# Altium schematic sheet 蔬菜大棚.SchDoc
size A3
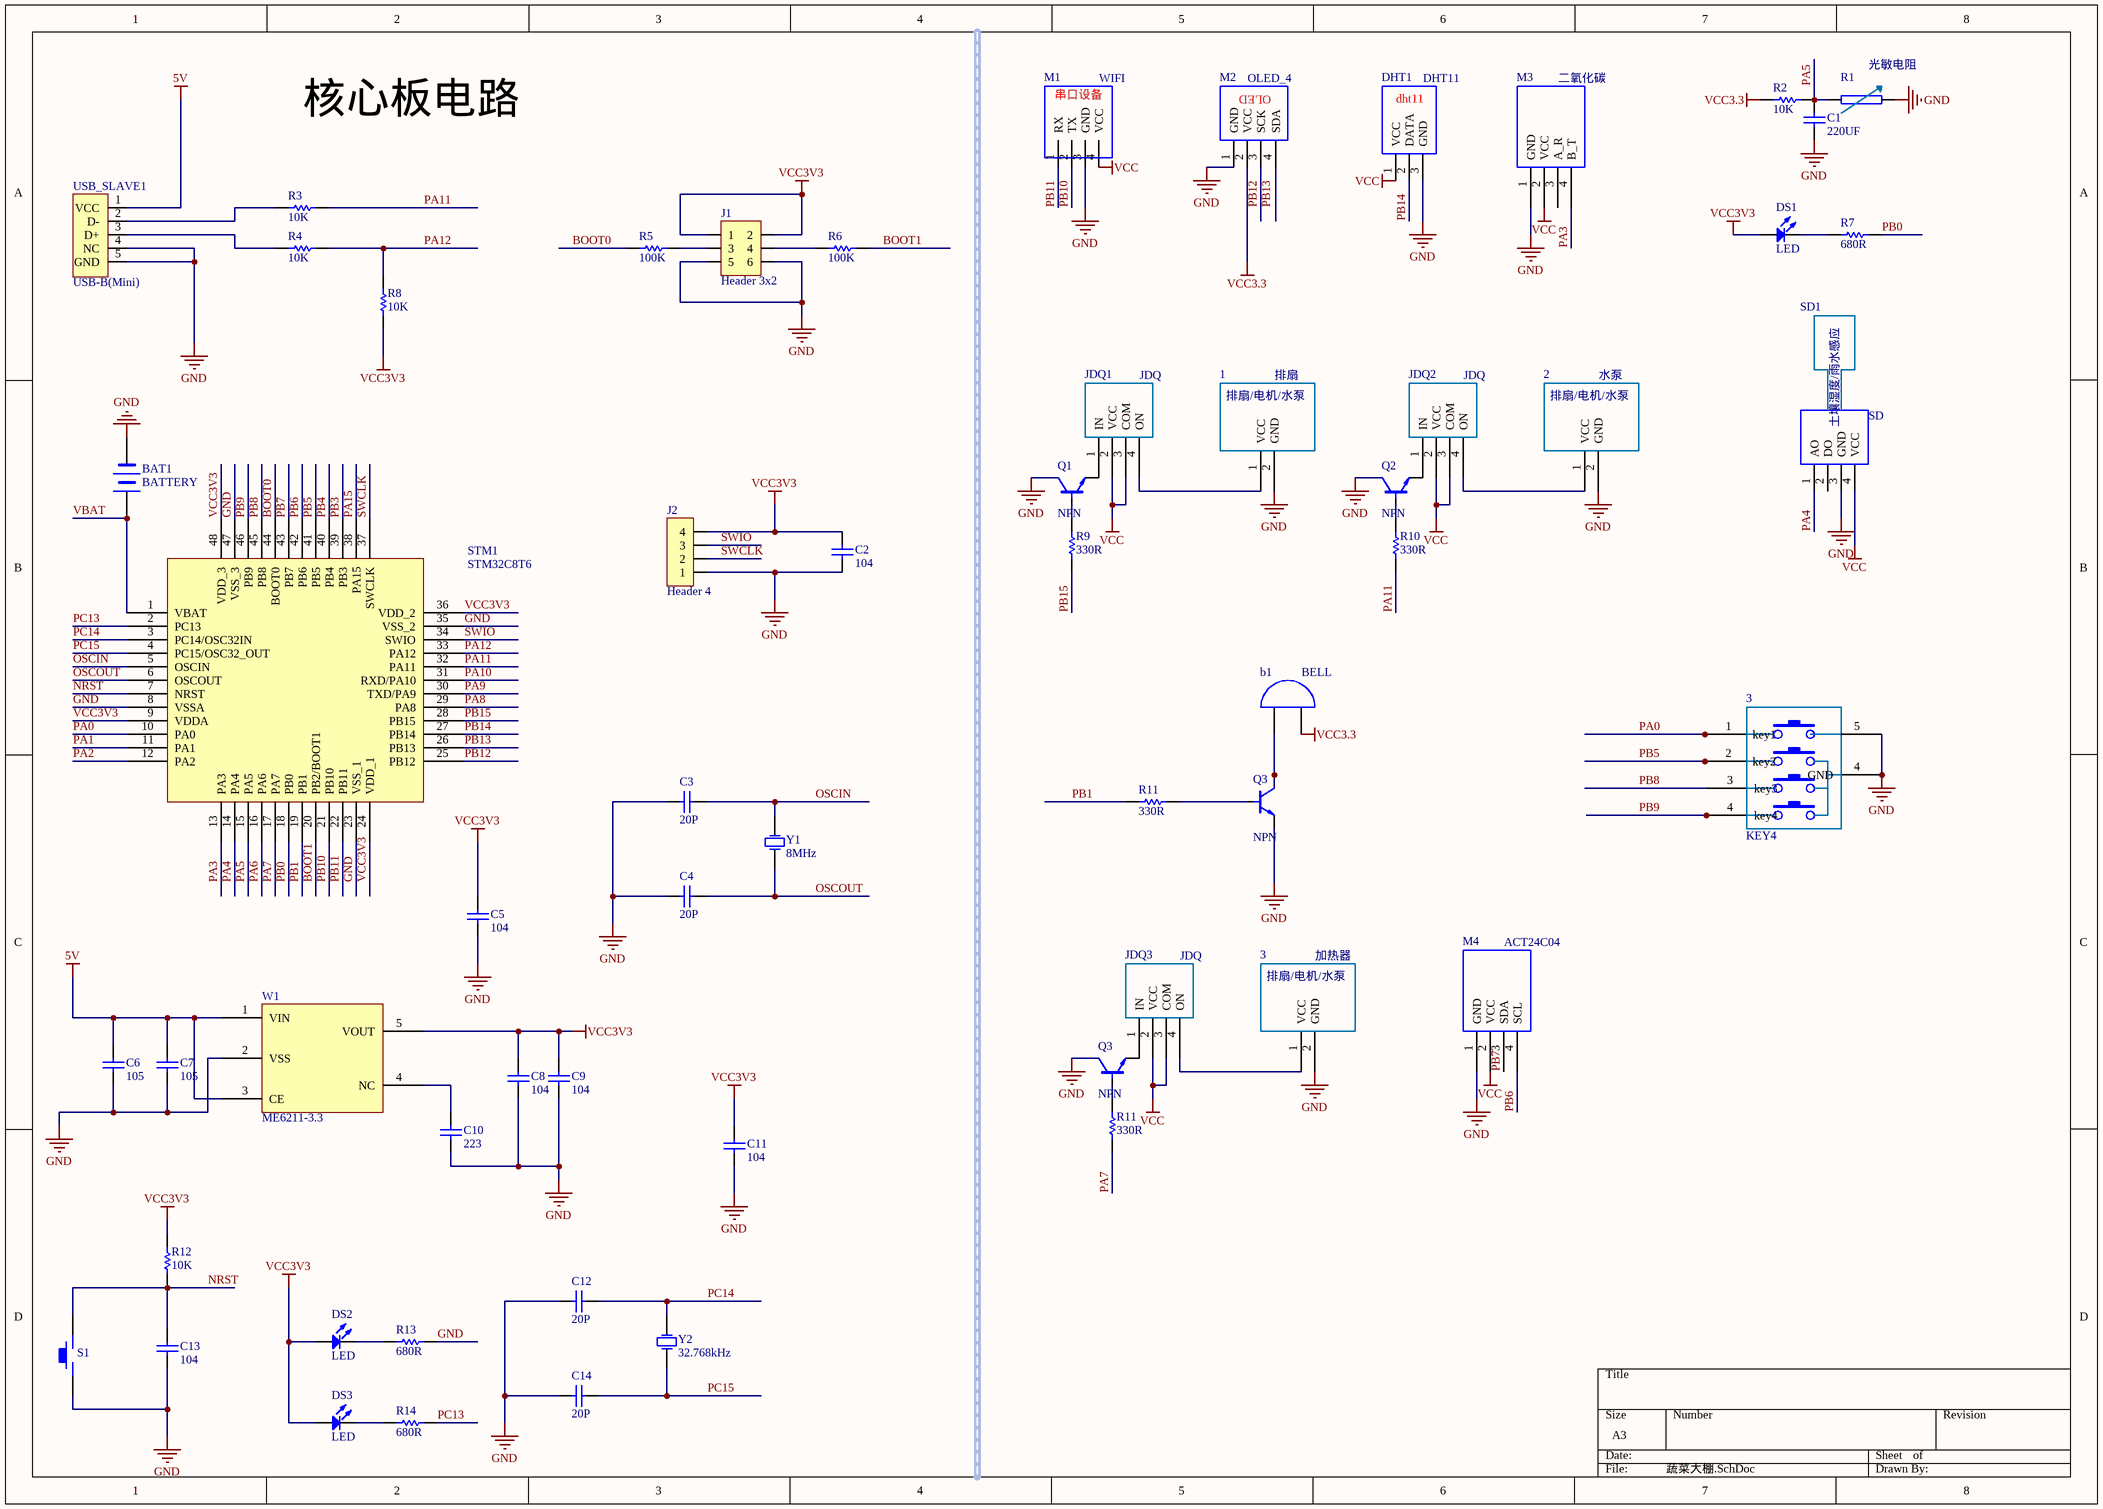
[diagram p0: 蔬菜大棚.SchDoc]

## Parts
(Parts that share a designator on the sheet are numbered #1, #2 ... from top to bottom, then left to right.)
1  排扇
2  水泵
3#1  KEY4
3#2  加热器
b1  BELL  [bell]
BAT1  BATTERY  [BATTERY]
C1  220UF  [C0603]
C2  104  [C0603]
C3  20P  [C0603]
C4  20P  [C0603]
C5  104  [C0603]
C6  105  [C0603]
C7  105  [C0603]
C8  104  [C0603]
C9  104  [C0603]
C10  223  [C0603]
C11  104  [C0603]
C12  20P  [C0603]
C13  104  [C0603]
C14  20P  [C0603]
DHT1  DHT11
DS1  LED  [LED0603]
DS2  LED  [LED0603]
DS3  LED  [LED0603]
J1  Header 3x2  [HDR2X3]
J2  Header 4  [HDR1X4-2MM]
JDQ1  JDQ
JDQ2  JDQ
JDQ3  JDQ
M1  WIFI
M2  OLED_4
M3  二氧化碳
M4  ACT24C04
Q1  NPN  [TO-92]
Q2  NPN  [TO-92]
Q3#1  NPN  [S9013]
Q3#2  NPN  [TO-92]
R1  光敏电阻
R2  10K  [R0603]
R3  10K  [R0603]
R4  10K  [R0603]
R5  100K  [R0603]
R6  100K  [R0603]
R7  680R  [R0603]
R8  10K  [R0603]
R9  330R  [R0603]
R10  330R  [R0603]
R11#1  330R  [AXIAL0.3]
R11#2  330R  [R0603]
R12  10K  [R0603]
R13  680R  [R0603]
R14  680R  [R0603]
S1  KEY  [DSW-KFC-022S-H2.5]  (value not drawn)
SD1  SD
STM1  STM32C8T6  [TQFP65P910X910X160-100N]
USB_SLAVE1  USB-B(Mini)  [USB-V3]
W1  ME6211-3.3  [ME6211-3.3]
Y1  8MHz  [X-HC49S]
Y2  32.768kHz  [X-MC146]

## Nets
5V: C6.2 C7.2 USB_SLAVE1.1(VCC) W1.1(VIN) W1.3(CE)
GND: 1.2(GND) 2.2(GND) 3#1.4(GND) 3#1.5 3#2.2(GND) BAT1.2(-) C1.1 C2.1 C3.1 C4.2 C5.1 C6.1 C7.1 C8.1 C9.1 C10.1 C11.1 C12.1 C13.1 C14.2 DHT1.3(GND) J1.5 J1.6 J2.1 M1.3(GND) M2.1(GND) M3.1(GND) M4.1(GND) Q3#1.E(e) R1.2 R13.2 S1.1 SD1.3(GND) STM1.8(VSSA) STM1.23(VSS_1) STM1.35(VSS_2) STM1.47(VSS_3) USB_SLAVE1.4(NC) USB_SLAVE1.5(GND) W1.2(VSS)
VCC: DHT1.1(VCC) JDQ1.2(VCC) JDQ1.3(COM) JDQ2.2(VCC) JDQ2.3(COM) JDQ3.2(VCC) JDQ3.3(COM) M1.4(VCC) M3.2(VCC) M4.2(VCC) SD1.4(VCC)
VCC3.3: b1.2 M2.2(VCC) R2.2
VCC3V3: C2.2 C5.2 C8.2 C9.2 C11.2 DS1.1(A) DS2.1(A) DS3.1(A) J1.1 J1.2 J2.4 R8.1 R12.2 STM1.9(VDDA) STM1.24(VDD_1) STM1.36(VDD_2) STM1.48(VDD_3) W1.5(VOUT)
BOOT0: R5.1 STM1.44(BOOT0)
BOOT1: R6.2 STM1.20(PB2/BOOT1)
NRST: C13.2 R12.1 S1.2 STM1.7(NRST)
OSCIN: C3.2 STM1.5(OSCIN) Y1.2(OSC2)
OSCOUT: C4.1 STM1.6(OSCOUT) Y1.1(OSC1)
PA0: 3#1.1(key1) STM1.10(PA0)
PA1: STM1.11(PA1)
PA2: STM1.12(PA2)
PA3: M3.4(B_T) STM1.13(PA3)
PA4: SD1.1(AO) STM1.14(PA4)
PA5: C1.2 R1.1 R2.1 STM1.15(PA5)
PA6: STM1.16(PA6)
PA7: R11#2.1 STM1.17(PA7)
PA8: STM1.29(PA8)
PA9: STM1.30(TXD/PA9)
PA10: STM1.31(RXD/PA10)
PA11: R3.2 R10.1 STM1.32(PA11)
PA12: R4.2 R8.2 STM1.33(PA12)
PA15: STM1.38(PA15)
PB0: R7.2 STM1.18(PB0)
PB1: R11#1.1 STM1.19(PB1)
PB3: STM1.39(PB3)
PB4: STM1.40(PB4)
PB5: 3#1.2(key2) STM1.41(PB5)
PB6: M4.4(SCL) STM1.42(PB6)
PB7: M4.3(SDA) STM1.43(PB7)
PB8: 3#1.3(key3) STM1.45(PB8)
PB9: 3#1.4(key4) STM1.46(PB9)
PB10: M1.2(TX) STM1.21(PB10)
PB11: M1.1(RX) STM1.22(PB11)
PB12: M2.3(SCK) STM1.25(PB12)
PB13: STM1.26(PB13)
PB14: DHT1.2(DATA) STM1.27(PB14)
PB15: R9.1 STM1.28(PB15)
PC13: R14.2 STM1.2(PC13)
PC14: C12.2 STM1.3(PC14/OSC32IN) Y2.1(OSC1)
PC15: C14.1 STM1.4(PC15/OSC32_OUT) Y2.2(OSC2)
SWCLK: J2.2 STM1.37(SWCLK)
SWIO: J2.3 STM1.34(SWIO)
VBAT: BAT1.1(+) STM1.1(VBAT)
Net1_1: 1.1(VCC) JDQ1.4(ON)
Net2_1: 2.1(VCC) JDQ2.4(ON)
Net3#2_1: 3#2.1(VCC) JDQ3.4(ON)
Netb1_1: b1.1 Q3#1.C(c)
NetC10_2: C10.2 W1.4(NC)
NetDS1_2: DS1.2(K) R7.1
NetDS2_2: DS2.2(K) R13.1
NetDS3_2: DS3.2(K) R14.1
NetJ1_3: J1.3 R5.2
NetJ1_4: J1.4 R6.1
NetJDQ1_1: JDQ1.1(IN) Q1.E(e)
NetJDQ2_1: JDQ2.1(IN) Q2.E(e)
NetJDQ3_1: JDQ3.1(IN) Q3#2.E(e)
NetQ1_B: Q1.B(b) R9.2
NetQ2_B: Q2.B(b) R10.2
NetQ3#1_B: Q3#1.B(b) R11#1.2
NetQ3#2_B: Q3#2.B(b) R11#2.2
NetR3_1: R3.1 USB_SLAVE1.2(D-)
NetR4_1: R4.1 USB_SLAVE1.3(D+)

Not connected (* = marked no-connect by the designer): M2 4(SDA); M3 3(A_R); SD1 2(DO)

## Notes on the sheet
- 核心板电路
- Labels drawn without touching a wire or pin: PB13
- (in symbol DHT11) dht11
- (in symbol OLED_4) OLED
- (in symbol 串口通信设备) 串口设备
- (in symbol 土壤湿度传感器) 土壤湿度/雨水感应
- (in symbol 排扇) 排扇/电机/水泵

## Library data of the parts
2 3#2 = 排扇
C1-C14 = C: 电容; Published: 8-Jun-2000; LatestRevisionDate: 17-Jul-2002; LatestRevisionNote: Re-released for DXP Platform.; PackageReference: RAD-0.3; Publisher: Altium Limited; PackageDescription: Radial Cap, Thru-Hole; 2 Leads; 0.3 in Pin Spacing
DS1-DS3 = LED: Typical RED, GREEN, YELLOW, AMBER GaAs LED; Published: 8-Jun-2000; LatestRevisionDate: 17-Jul-2002; LatestRevisionNote: Re-released for DXP Platform.; PackageDocument: Feb-2002; PackageReference: 3.2X1.6X1.1; Publisher: Altium Limited
J1 = Header 3x2: Header, 6-Pin; LatestRevisionDate: 17-Jul-2002; LatestRevisionNote: Re-released for DXP Platform.; Publisher: Altium Limited
J2 = Header 4: Header, 4-Pin; LatestRevisionDate: 17-Jul-2002; LatestRevisionNote: Re-released for DXP Platform.; Publisher: Altium Limited
JDQ1-JDQ3 = 4脚继电器
M1 = 串口通信设备
M3 M4 = JW01
R2-R10 R11#1 R11#2 R12-R14 = RES0603: 电阻; Published: 8-Jun-2000; LatestRevisionDate: 17-Jul-2002; LatestRevisionNote: Re-released for DXP Platform.; PackageReference: AXIAL-0.3; Publisher: Altium Limited; PackageDescription: Axial Device, Thru-Hole; 2 Leads; 0.3 in Pin Spacing
S1 = KEY: 普通轻触按钮
SD1 = 土壤湿度传感器
USB_SLAVE1 = USB5
Y1 Y2 = XTAL: Crystal Oscillator; Published: 8-Jun-2000; LatestRevisionDate: 17-Jul-2002; LatestRevisionNote: Re-released for DXP Platform.; Publisher: Altium Limited